# Altium project Project_IHM.PrjPcb
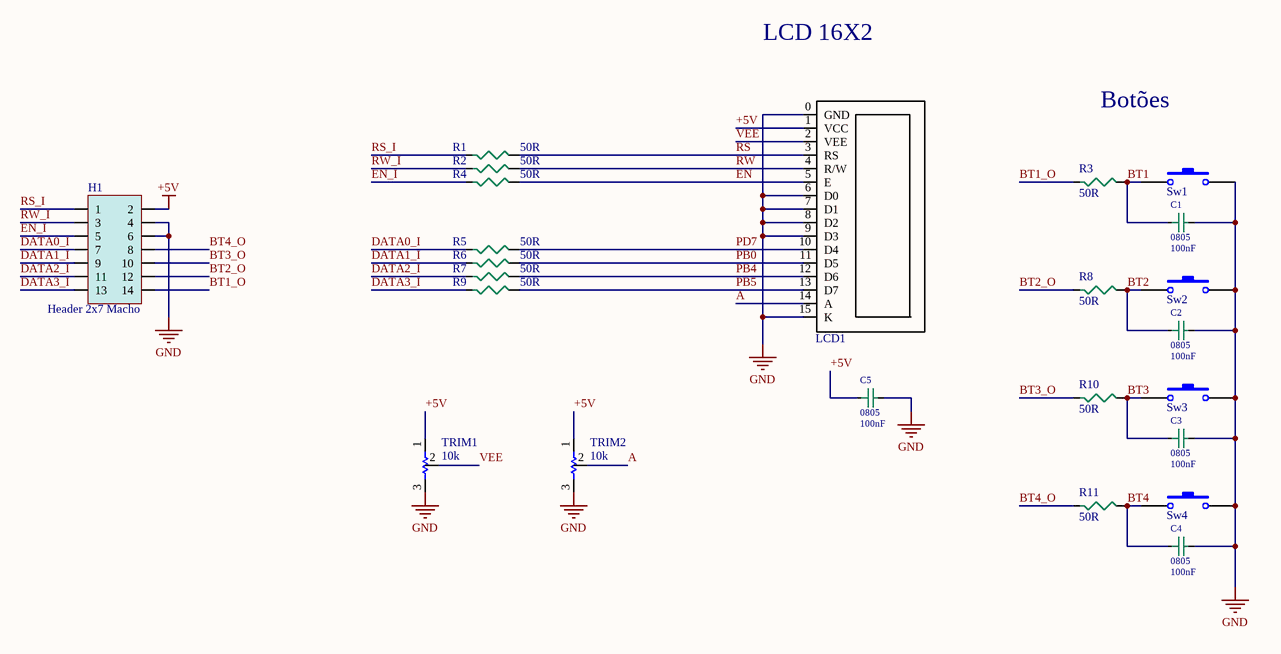
[diagram p0: Schematic.SchDoc]
1 sheet, 24 parts. Net scope: global (net labels, ports and power ports of the same name join across sheets).
Board file: PCB.PcbDoc

## Sheet Schematic.SchDoc
size A4

### Parts
C1  0805  value 100nF  [0805C]
C2  0805  value 100nF  [0805C]
C3  0805  value 100nF  [0805C]
C4  0805  value 100nF  [0805C]
C5  0805  value 100nF  [0805C]
H1  Header 2x7 Macho  [HEADER 2X7]
LCD1  LCD*  [LCD16X2]  (value not drawn)
R1  value 50R  [0805]  (hidden comment: 0805)
R2  value 50R  [0805]  (hidden comment: 0805)
R3  value 50R  [0805]  (hidden comment: 0805)
R4  value 50R  [0805]  (hidden comment: 0805)
R5  value 50R  [0805]  (hidden comment: 0805)
R6  value 50R  [0805]  (hidden comment: 0805)
R7  value 50R  [0805]  (hidden comment: 0805)
R8  value 50R  [0805]  (hidden comment: 0805)
R9  value 50R  [0805]  (hidden comment: 0805)
R10  value 50R  [0805]  (hidden comment: 0805)
R11  value 50R  [0805]  (hidden comment: 0805)
Sw1  SW_PUSH_BUTTON  [PUSH_BUTTON]  (value not drawn)
Sw2  SW_PUSH_BUTTON  [PUSH_BUTTON]  (value not drawn)
Sw3  SW_PUSH_BUTTON  [PUSH_BUTTON]  (value not drawn)
Sw4  SW_PUSH_BUTTON  [PUSH_BUTTON]  (value not drawn)
TRIM1  value 10k  [Trimpot Vertical]  (hidden comment: Trimpot Vertical)
TRIM2  value 10k  [Trimpot Vertical]  (hidden comment: Trimpot Vertical)

### Nets
+5V: C5.1 H1.2 LCD1.1(VCC) TRIM1.1 TRIM2.1
GND: C1.2 C2.2 C3.2 C4.2 C5.2 H1.4 H1.6 LCD1.0(GND) LCD1.6(D0) LCD1.7(D1) LCD1.8(D2) LCD1.9(D3) LCD1.15(K) Sw1.2 Sw2.2 Sw3.2 Sw4.2 TRIM1.3 TRIM2.3
A: LCD1.14(A) TRIM2.2
BT1: C1.1 R3.2 Sw1.1
BT1_O: H1.14 R3.1
BT2: C2.1 R8.2 Sw2.1
BT2_O: H1.12 R8.1
BT3: C3.1 R10.2 Sw3.1
BT3_O: H1.10 R10.1
BT4: C4.1 R11.2 Sw4.1
BT4_O: H1.8 R11.1
DATA0_I: H1.7 R5.1
DATA1_I: H1.9 R6.1
DATA2_I: H1.11 R7.1
DATA3_I: H1.13 R9.1
EN: LCD1.5(E) R4.2
EN_I: H1.5 R4.1
PB0: LCD1.11(D5) R6.2
PB4: LCD1.12(D6) R7.2
PB5: LCD1.13(D7) R9.2
PD7: LCD1.10(D4) R5.2
RS: LCD1.3(RS) R1.2
RS_I: H1.1 R1.1
RW: LCD1.4(R/W) R2.2
RW_I: H1.3 R2.1
VEE: LCD1.2(VEE) TRIM1.2

### Notes on the sheet
- LCD 16X2
- Botões

### Library data of the parts
C1-C5 = Capacitor SMD 0805
LCD1 = LCD 16x2
R1-R11 = Resistor SMD 0805 1/8 W: %: ±1%; P: 1/8W
Sw1-Sw4 = SW-PB: Switch Push Button; Published: 24-Mar-1999; LatestRevisionDate: 17-Jul-2002; LatestRevisionNote: Re-released for DXP Platform.; PackageReference: SPST-2; Publisher: Altium Limited